# Altium schematic sheet WiFiKernel.SchDoc
size A4
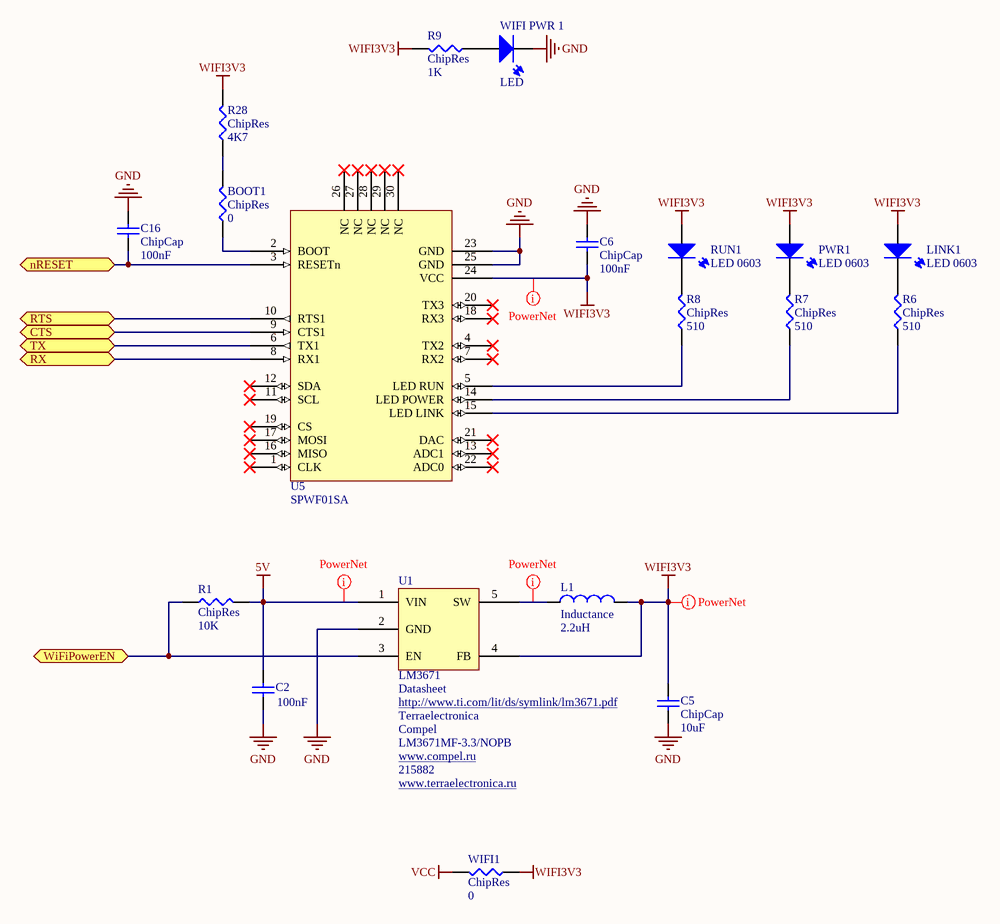
[diagram p0: WiFiKernel.SchDoc]

## Parts
BOOT1  ChipRes  value 0  [RES0805]
C2  value 100nF  [CAP1210]  (hidden comment: ChipCap)
C5  ChipCap  value 10uF  [CAP1210]
C6  ChipCap  value 100nF  [CAP0805]
C16  ChipCap  value 100nF  [CAP0805]
L1  Inductance  value 2.2uH  [CDRH2D14]
LINK1  LED 0603  [LED 0603]
PWR1  LED 0603  [LED 0603]
R1  ChipRes  value 10K  [RES0805]
R6  ChipRes  value 510  [RES0805]
R7  ChipRes  value 510  [RES0805]
R8  ChipRes  value 510  [RES0805]
R9  ChipRes  value 1K  [RES0805]
R28  ChipRes  value 4K7  [RES0805]
RUN1  LED 0603  [LED 0603]
U1  LM3671  ComponentLink1Description: Datasheet  Supplier 1: Terraelectronica  Supplier 2: Compel  Supplier Part Number 2: LM3671MF-3.3/NOPB  Supplier Part Number 1: 215882  [SOT23-5]
U5  SPWF01SA  [SPWF01SA]
WIFI1  ChipRes  value 0  [RES0805]
WIFI_PWR_1  LED  [PLCC-2]

## Ports
CTS, nRESET, RTS, RX, TX, WiFiPowerEN

## Nets
5V: C2.2 R1.2 U1.1(VIN)
GND: C2.1 C5.1 C6.1 C16.1 U1.2(GND) U5.23(GND) U5.25(GND) WIFI_PWR_1.1
VCC: WIFI1.2
WIFI3V3: C5.2 C6.2 L1.1 LINK1.2 PWR1.2 R9.2 R28.1 RUN1.2 U1.4(FB) U5.24(VCC) WIFI1.1
CTS: U5.9(CTS1) ; port CTS
nRESET: C16.2 U5.3(RESETn) ; port nRESET
RTS: U5.10(RTS1) ; port RTS
RX: U5.8(RX1) ; port RX
TX: U5.6(TX1) ; port TX
WiFiPowerEN: R1.1 U1.3(EN) ; port WiFiPowerEN
NetBOOT1_1: BOOT1.1 R28.2
NetBOOT1_2: BOOT1.2 U5.2(BOOT)
NetL1_2: L1.2 U1.5(SW)
NetLINK1_1: LINK1.1 R6.1
NetPWR1_1: PWR1.1 R7.1
NetR6_2: R6.2 U5.15(LED_LINK)
NetR7_2: R7.2 U5.14(LED_POWER)
NetR8_1: R8.1 RUN1.1
NetR8_2: R8.2 U5.5(LED_RUN)
NetR9_1: R9.1 WIFI_PWR_1.2

Not connected (* = marked no-connect by the designer): U5 1(CLK)* 4(TX2)* 7(RX2)* 11(SCL)* 12(SDA)* 13(ADC1)* 16(MISO)* 17(MOSI)* 18(RX3)* 19(CS)* 20(TX3)* 21(DAC)* 22(ADC0)* 26(NC)* 27(NC)* 28(NC)* 29(NC)* 30(NC)*

## Layout directives
net class Undefined: 5V, NetL1_2, WIFI3V3

## Library data of the parts
BOOT1 R1 R6-R9 R28 WIFI1 = ChipRes: Chip resistor
C2 C5 C6 C16 = ChipCap: Capacitor; Published: 8-Jun-2000; LatestRevisionDate: 17-Jul-2002; LatestRevisionNote: Re-released for DXP Platform.; PackageReference: RAD-0.3; Publisher: Altium Limited
L1 = ChipInductance
LINK1 PWR1 RUN1 WIFI_PWR_1 = LED0603
U1 = LM3671MF: 600-mA Step-Down DC-DC Converter; ComponentLink1URL: http://www.ti.com/lit/ds/symlink/lm3671.pdf; Supplier URL 2: www.compel.ru; Supplier URL 1: www.terraelectronica.ru
U5 = SPWF01: Serial-to-Wi-Fi b/g/n intelligent module